# Altium schematic sheet OTHERTEST_1.SchDoc
size 228 x 144 mm
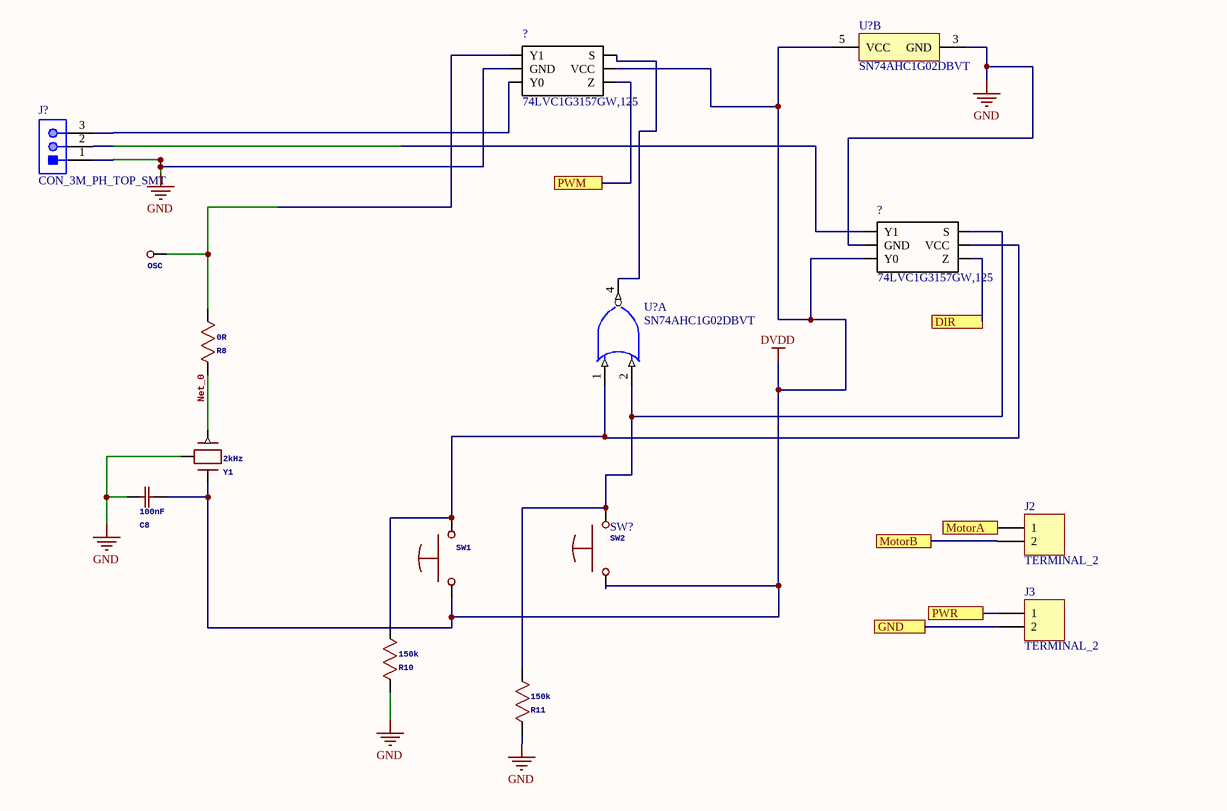
[diagram p0: OTHERTEST_1.SchDoc]

## Parts
(Parts that share a designator on the sheet are numbered #1, #2 ... from top to bottom, then left to right.)
?#1  74LVC1G3157GW,125  [SOT363]
?#2  74LVC1G3157GW,125  [SOT363]
C8  100nF  NAME: C8  [CAP_0603]
J2  TERMINAL_2  [OSTYK51102030]
J3  TERMINAL_2  [OSTYK51102030]
J?  CON_3M_PH_TOP_SMT  [JST-B3B-SM4-TB]
OSC  NAME: OSC  [TESTPAD_1.5mm]  (hidden comment: TESTPOINT)
R8  0R  NAME: R8  [RES_0603]
R10  150k  NAME: R10  [RES_0603]
R11  150k  NAME: R11  [RES_0603]
SW2  NAME: SW1  [PUSHBUTTON_RECTANGLE]  (hidden comment: PUSHBUTTON_TACTILE)
SW?  NAME: SW2  [PUSHBUTTON_RECTANGLE]  (hidden comment: PUSHBUTTON_TACTILE)
U?#1  SN74AHC1G02DBVT  [DBV0005A_N]  (part B of 2)
U?#2  SN74AHC1G02DBVT  [DBV0005A_N]  (part A of 2)
Y1  2kHz  NAME: Y1  [4_lead_CDFN3225]

## Ports
DIR, GND, MotorA, MotorB, PWM, PWR

## Nets
DVDD: ?#1.5(VCC) ?#2.3(Y0) C8.1 SW2.1(C1) SW?.1(C1) U?#1.5(VCC) Y1.4(VDD)
GND: ?#1.2(GND) ?#2.2(GND) C8.2 J?.1 R10.2 R11.2 U?#1.3(GND) Y1.2(GND)
DIR: ?#2.4(Z) ; port DIR
GND: J3.2 ; port GND  [a separate net that carries the same name]
MotorA: J2.1 ; port MotorA
MotorB: J2.2 ; port MotorB
Net_0: R8.1 Y1.1(OUT)
PWM: ?#1.4(Z) ; port PWM
PWR: J3.1 ; port PWR
Net?#1_1: ?#1.1(Y1) OSC.1 R8.2
Net?#1_3: ?#1.3(Y0) J?.3
Net?#1_6: ?#1.6(S) U?#2.4(Y)
Net?#2_1: ?#2.1(Y1) J?.2
Net?#2_5: ?#2.5(VCC) R10.1 SW2.2(C2) U?#2.1(A)
Net?#2_6: ?#2.6(S) R11.1 SW?.2(C2) U?#2.2(B)

## Library data of the parts
?#1 ?#2 = 74LVC1G3157GW,125: 74LVC1G3157 - 2-channel analog multiplexer/demultiplexer; MF: Nexperia USA; SnapEDA_Link: https://www.snapeda.com/parts/74LVC1G3157GW%2C125/Nexperia%20USA%20Inc./view-part/?ref=snap; Availability: Unavailable; Price: None; MP: 74LVC1G3157GW,125; Package: SOT-363 Nexperia; Value: *
C8 = CAP_100NF_0603: MANUFACTURER: Yageo; MPN: CC0603KRX7R7BB104; GateName_1: PART_1; SymbolName_1: CAP_100NF_0603; LibraryName: common; DeviceSetName: CAP_100NF_0603
J2 J3 = TERMINAL_2: Header, 2-Pin; LatestRevisionDate: 17-Jul-2002; LatestRevisionNote: Re-released for DXP Platform.; Publisher: Altium Limited
J? = CON_3M_PH_TOP_SMT: CONN HEADER PH TOP 3POS 2MM SMD; Manufacturer: JST; Part Number: B3B-PH-SM4-TB; ComponentLink1Description: Datasheet; ComponentLink1URL: http://www.jst-mfg.com/product/pdf/eng/ePH.pdf
OSC = TESTPOINT: GateName_1: PART_1; SymbolName_1: TESTPOINT; LibraryName: common; DeviceSetName: TESTPOINT
R8 = RES_0R_0603: MANUFACTURER: Yageo; MPN: RC0603JR-070RL; GateName_1: PART_1; SymbolName_1: RES_0R_0603; LibraryName: common; DeviceSetName: RES_0R_0603
R10 R11 = RES_150K_0603: MANUFACTURER: Yageo; MPN: RC0603JR-07150KL; GateName_1: PART_1; SymbolName_1: RES_150K_0603; LibraryName: common; DeviceSetName: RES_150K_0603; DATASHEET: http://www.yageo.com/documents/recent/PYu-RC_Group_51_RoHS_L_8.pdf
SW2 SW? = PUSHBUTTON_TACTILE: MANUFACTURER: C&K; MPN: RS-282G05A3-SM RT; GateName_1: PART_1; ATTR_1: Normally Open; SymbolName_1: PUSHBUTTON_TACTILE; LibraryName: common; DeviceSetName: PUSHBUTTON_TACTILE
U?#1 U?#2 = SN74AHC1G02DBVT: Single 2-Input Positive-NOR Gate, DBV0005A, SMALL T&R; Manufacturer: Texas Instruments; VCC(Min)(V): 2; VCC(Max)(V): 5.5; Output Type: CMOS; ICC @ Nom Voltage(Max)(mA): 0.01; Bits(#): 1; F @ Nom Voltage(Max)(Mhz): 75; Rating: Catalog; Technology Family: AHC; Voltage(Nom)(V): 3.3,5; Schmitt Trigger: No; Output Drive (IOL/IOH)(Max)(mA): 50/-50; tpd @ Nom Voltage(Max)(ns): 11.4,7.5; Logic: True; Gate Type: NOR; Sub-Family: NAND Gate; DatasheetVersion: SCLS342M; PackageReference: DBV0005A; Supplier 1: Mouser; Supplier Part Number 1: 595-SN74AHC1G02DBVT; Supplier 2: Digi-Key; Supplier Part Number 2: SN74AHC1G02DBVT-ND; Generic Part Number: SN74AHC1G02; Input Type: CMOS; Operating Temperature Range(C): -40 to 125,-40 to 85; 3-State Output: No; PartNumber: SN74AHC1G02DBVT; ComponentLink1Description: Manufacturer URL; ComponentLink1URL: http://www.ti.com/; ComponentLink2Description: Datasheet; ComponentLink2URL: http://www.ti.com/lit/ds/symlink/sn74ahc1g02.pdf
Y1 = OSCILLATOR_2KHZ: MANUFACTURER: Microchip Technology; MPN: DSC6083CI2A-002K000; GateName_1: PART_1; SymbolName_1: OSCILLATOR_2KHZ; LibraryName: common; DeviceSetName: OSCILLATOR_2KHZ; DATASHEET: http://ww1.microchip.com/downloads/en/DeviceDoc/20005625B.pdf